# Altium project US29080671(A).PrjPCB (part 4 of 10)

## Sheet POWER_B2.SchDoc
size A4
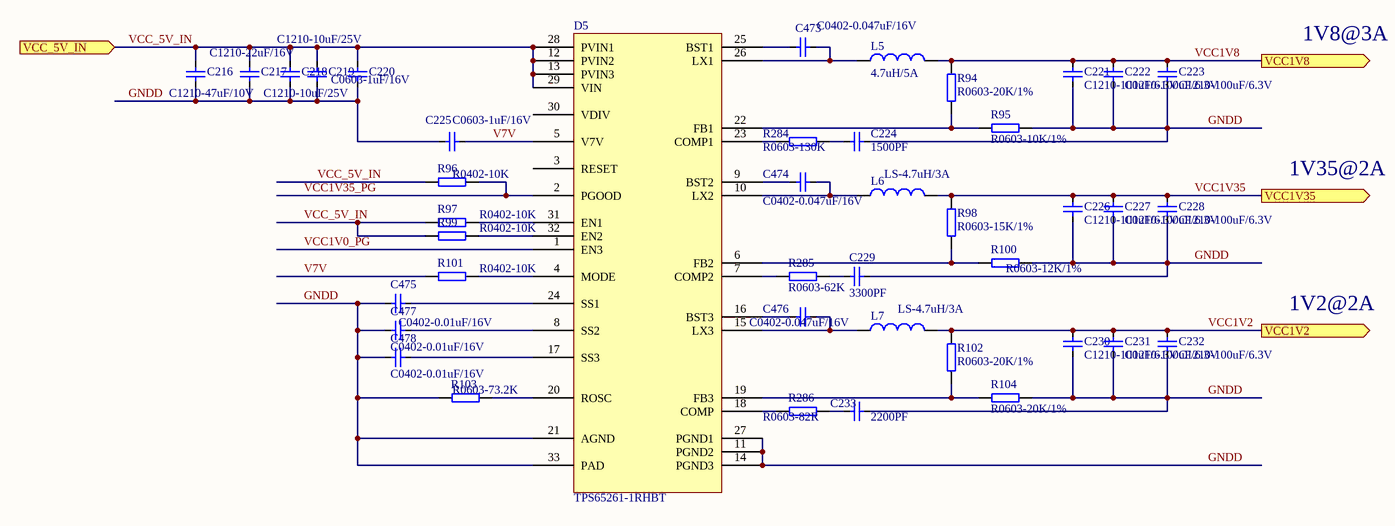
[diagram p19: POWER_B2.SchDoc]

### Parts
C216  C1210-47uF/10V  [C1210]
C217  C1210-22uF/16V  [C1210]
C218  C1210-10uF/25V  [C1210]
C219  C1210-10uF/25V  [C1210]
C220  C0603-1uF/16V  [C0603]
C221  C1210-100uF/6.3V  [C1210]
C222  C1210-100uF/6.3V  [C1210]
C223  C1210-100uF/6.3V  [C1210]
C224  1500PF  [C0603]
C225  C0603-1uF/16V  [C0603]
C226  C1210-100uF/6.3V  [C1210]
C227  C1210-100uF/6.3V  [C1210]
C228  C1210-100uF/6.3V  [C1210]
C229  3300PF  [C0603]
C230  C1210-100uF/6.3V  [C1210]
C231  C1210-100uF/6.3V  [C1210]
C232  C1210-100uF/6.3V  [C1210]
C233  2200PF  [C0603]
C473  C0402-0.047uF/16V  [C0402]
C474  C0402-0.047uF/16V  [C0402]
C475  C0402-0.01uF/16V  [C0402]
C476  C0402-0.047uF/16V  [C0402]
C477  C0402-0.01uF/16V  [C0402]
C478  C0402-0.01uF/16V  [C0402]
D5  TPS65261-1RHBT  [QFN-32N]
L5  4.7uH/5A  [LSMD12-13X13]
L6  LS-4.7uH/3A  [FMJ-0630T]
L7  LS-4.7uH/3A  [FMJ-0630T]
R94  R0603-20K/1%  [R0603]
R95  R0603-10K/1%  [R0603]
R96  R0402-10K  [R0402]
R97  R0402-10K  [R0402]
R98  R0603-15K/1%  [R0603]
R99  R0402-10K  [R0402]
R100  R0603-12K/1%  [R0603]
R101  R0402-10K  [R0402]
R102  R0603-20K/1%  [R0603]
R103  R0603-73.2K  [R0603]
R104  R0603-20K/1%  [R0603]
R284  R0603-130K  [R0603]
R285  R0603-62K  [R0603]
R286  R0603-82R  [R0603]

### Ports
VCC1V2 (out), VCC1V8 (out), VCC1V35 (out), VCC_5V_IN (in)

### Nets
GNDD: C216.2 C217.2 C218.2 C219.2 C220.2 C221.2 C222.2 C223.2 C224.2 C225.1 C226.2 C227.2 C228.2 C229.2 C230.2 C231.2 C232.2 C233.2 C475.1 C477.1 C478.1 D5.11(PGND2) D5.14(PGND3) D5.21(AGND) D5.27(PGND1) D5.33(PAD) R95.2 R100.2 R103.1 R104.2
VCC1V2: C230.1 C231.1 C232.1 L7.2 R102.2 ; port VCC1V2
VCC1V8: C221.1 C222.1 C223.1 L5.2 R94.2 ; port VCC1V8
VCC1V35: C226.1 C227.1 C228.1 L6.2 R98.2 ; port VCC1V35
V7V: C225.2 D5.5(V7V) R101.1
VCC1V0_PG: D5.1(EN3)
VCC1V35_PG: D5.2(PGOOD) R96.2
VCC_5V_IN: C216.1 C217.1 C218.1 C219.1 C220.1 D5.12(PVIN2) D5.13(PVIN3) D5.28(PVIN1) D5.29(VIN) R96.1 R97.1 R99.1 ; port VCC_5V_IN
NetC224_1: C224.1 R284.2
NetC229_1: C229.1 R285.2
NetC233_1: C233.1 R286.2
NetC473_1: C473.1 D5.25(BST1)
NetC473_2: C473.2 D5.26(LX1) L5.1
NetC474_1: C474.1 D5.9(BST2)
NetC474_2: C474.2 D5.10(LX2) L6.1
NetC475_2: C475.2 D5.24(SS1)
NetC476_1: C476.1 D5.16(BST3)
NetC476_2: C476.2 D5.15(LX3) L7.1
NetC477_2: C477.2 D5.8(SS2)
NetC478_2: C478.2 D5.17(SS3)
NetD5_4: D5.4(MODE) R101.2
NetD5_6: D5.6(FB2) R98.1 R100.1
NetD5_7: D5.7(COMP2) R285.1
NetD5_18: D5.18(COMP) R286.1
NetD5_19: D5.19(FB3) R102.1 R104.1
NetD5_20: D5.20(ROSC) R103.2
NetD5_22: D5.22(FB1) R94.1 R95.1
NetD5_23: D5.23(COMP1) R284.1
NetD5_31: D5.31(EN1) R97.2
NetD5_32: D5.32(EN2) R99.2

Not connected (* = marked no-connect by the designer): D5 3(RESET) 30(VDIV)

### Notes on the sheet
- 1V8@3A
- 1V35@2A
- 1V2@2A

### Library data of the parts
C216 C218 C219 C221-C223 C226-C228 C230-C232 = C1210-22uF/16V: Part_type: CAP; Schematic_Part: CAP; PCB_Footprint: C1210
  C216: Part_number: C1210-47uF/10V; Value: C1210-47uF/10V
  C218 C219: Part_number: C1210-10uF/25V; Value: C1210-10uF/25V
  C221-C223 C226-C228 C230-C232: Part_number: C1210-100uF/6.3V; Value: C1210-100uF/6.3V
C220 C225 = C0603-100nF/16V: X7R; Part_number: C0603-1uF/16V; Part_type: CAP; Value: C0603-1uF/16V; temperature: -55℃\+125℃; Schematic_Part: CAP; PCB_Footprint: C0603
C224 C229 C233 = C1210-22uF/16V: PCB_Footprint: C1210; Part_type: CAP; Schematic_Part: CAP
  C224: Part_number: 1500PF; Value: 1500PF
  C229: Part_number: 3300PF; Value: 3300PF
  C233: Part_number: 2200PF; Value: 2200PF
C473-C478 = C0402-0.1uF/16V: as C3 on sheet A7_JTAG&CONFIG - Ⅱ; Part_type: CAP; temperature: -55℃\+125℃; Schematic_Part: CAP; PCB_Footprint: C0402; datasheet: #DataSheet\C_Samsung_General Capacitors.pdf#
  C473 C474 C476: Part_number: C0402-0.047uF/16V; Value: C0402-0.047uF/16V
  C475 C477 C478: Part_number: C0402-0.01uF/16V; Value: C0402-0.01uF/16V
D5 = TPS65261RHBT: Part_number: TPS65261-1RHBT
L5 = LS-6.8uH/5A: Part_number: 4.7uH/5A; Part_type: INDUCTOR; Value1: 6.8uH/5A; Schematic_Part: INDUCTOR; PCB_Footprint: LSMD12-13X13
L6 L7 = LS-4.7uH/5.5A: 7.3*6.6*3mm,4.7uH/5.5A,40mR,20%,TMP; Manufacturer_p/n: FMJ-0630T-4R7 HF; Part_number: LS-4.7uH/3A; Part_type: INDUCTOR; temperature: -55℃\+125℃; Value1: 4.7uH/3A; Schematic_Part: INDUCTOR; PCB_Footprint: FMJ-0630T; Manufacturer: TMP; datasheet: #DataSheet\IND_TMP_FMJ-0630T.pdf#
R94 R95 R98 R100 R103 R284-R286 = R0603-0R: as R2 on sheet POWER_B1; Part_type: RES; Schematic_Part: RES; PCB_Footprint: R0603; Manufacturer_p/n2: SAMSUNG
  R94: Part_number: R0603-20K/1%; Value: R0603-20K/1%
  R95: Part_number: R0603-10K/1%; Value: R0603-10K/1%
  R98: Part_number: R0603-15K/1%; Value: R0603-15K/1%
  R100: Part_number: R0603-12K/1%; Value: R0603-12K/1%
  R103: Part_number: R0603-73.2K; Value: R0603-73.2K
  R284: Part_number: R0603-130K; Value: R0603-130K
  R285: Part_number: R0603-62K; Value: R0603-62K
  R286: Part_number: R0603-82R; Value: R0603-82R
R96 R97 R99 R101 = R0402-10K: Manufacturer: SAMSUNG; Part_number: R0402-10K; Part_type: RES; Value: R0402-10K; Schematic_Part: RES; PCB_Footprint: R0402
R102 = R0603-0R: Manufacturer: HKT; Manufacturer_p/n: RI0603L000JT; Value: R0603-10K/1%; Part_number: R0603-20K/1%; Part_type: RES; Schematic_Part: RES; PCB_Footprint: R0603; Manufacturer_p/n2: SAMSUNG
R104 = R0603-0R: Manufacturer: HKT; Manufacturer_p/n: RI0603L000JT; Value: R0603-12K/1%; Part_number: R0603-20K/1%; Part_type: RES; Schematic_Part: RES; PCB_Footprint: R0603; Manufacturer_p/n2: SAMSUNG
C217 = C1210-22uF/16V: Part_number: C1210-22uF/16V; Part_type: CAP; Value: C1210-22uF/16V; Schematic_Part: CAP; PCB_Footprint: C1210

## Sheet POWER_B3.SchDoc
size A4
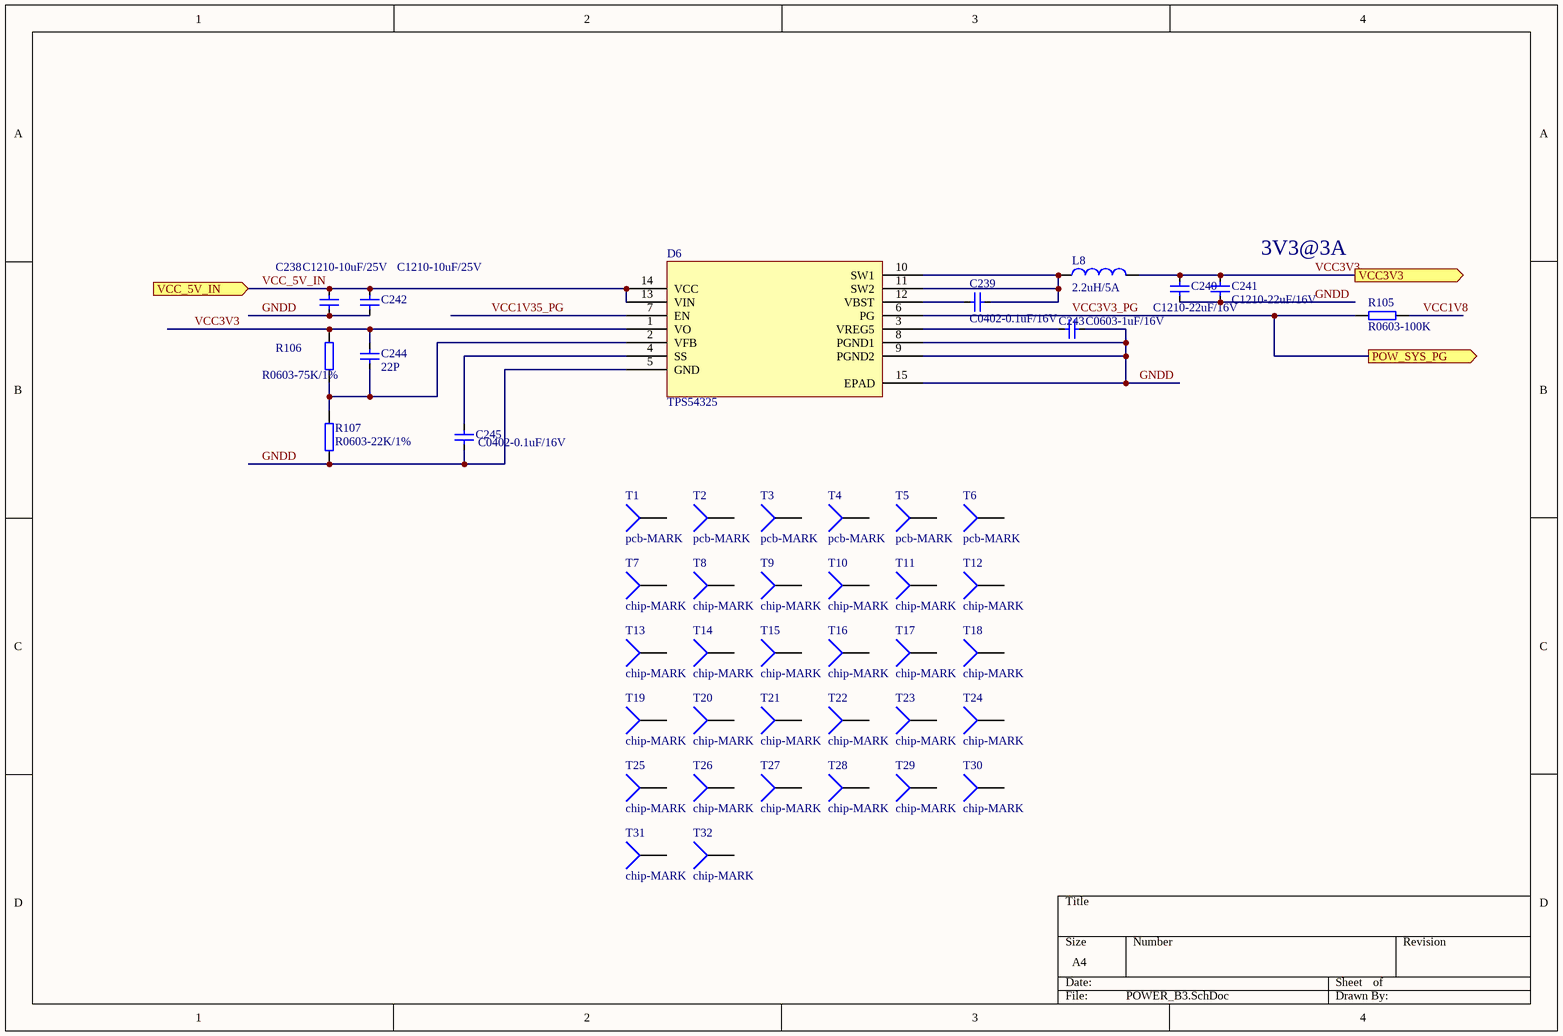
[diagram p20: POWER_B3.SchDoc]

### Parts
C238  C1210-10uF/25V  [C1210]
C239  C0402-0.1uF/16V  [C0402]
C240  C1210-22uF/16V  [C1210]
C241  C1210-22uF/16V  [C1210]
C242  C1210-10uF/25V  [C1210]
C243  C0603-1uF/16V  [C0603]
C244  22P  [C0603]
C245  C0402-0.1uF/16V  [C0402]
D6  TPS54325  [HTSSOP-14]
L8  2.2uH/5A  [LSMD12-13X13]
R105  R0603-100K  [R0603]
R106  R0603-75K/1%  [R0603]
R107  R0603-22K/1%  [R0603]
T1  pcb-MARK  [pcb-MARK]
T2  pcb-MARK  [pcb-MARK]
T3  pcb-MARK  [pcb-MARK]
T4  pcb-MARK  [pcb-MARK]
T5  pcb-MARK  [pcb-MARK]
T6  pcb-MARK  [pcb-MARK]
T7  chip-MARK  [chip-MARK]
T8  chip-MARK  [chip-MARK]
T9  chip-MARK  [chip-MARK]
T10  chip-MARK  [chip-MARK]
T11  chip-MARK  [chip-MARK]
T12  chip-MARK  [chip-MARK]
T13  chip-MARK  [chip-MARK]
T14  chip-MARK  [chip-MARK]
T15  chip-MARK  [chip-MARK]
T16  chip-MARK  [chip-MARK]
T17  chip-MARK  [chip-MARK]
T18  chip-MARK  [chip-MARK]
T19  chip-MARK  [chip-MARK]
T20  chip-MARK  [chip-MARK]
T21  chip-MARK  [chip-MARK]
T22  chip-MARK  [chip-MARK]
T23  chip-MARK  [chip-MARK]
T24  chip-MARK  [chip-MARK]
T25  chip-MARK  [chip-MARK]
T26  chip-MARK  [chip-MARK]
T27  chip-MARK  [chip-MARK]
T28  chip-MARK  [chip-MARK]
T29  chip-MARK  [chip-MARK]
T30  chip-MARK  [chip-MARK]
T31  chip-MARK  [chip-MARK]
T32  chip-MARK  [chip-MARK]

### Ports
POW_SYS_PG (out), VCC3V3 (out), VCC_5V_IN (in)

### Nets
GNDD: C238.2 C240.2 C241.2 C242.2 C243.2 C245.2 D6.5(GND) D6.8(PGND1) D6.9(PGND2) D6.15(EPAD) R107.1
VCC1V8: R105.2
VCC3V3: C240.1 C241.1 C244.1 D6.1(VO) L8.2 R106.2 ; port VCC3V3
VCC1V35_PG: D6.7(EN)
VCC3V3_PG: D6.6(PG) R105.1 ; port POW_SYS_PG  [project net POW_SYS_PG]
VCC_5V_IN: C238.1 C242.1 D6.13(VIN) D6.14(VCC) ; port VCC_5V_IN
NetC239_1: C239.1 D6.12(VBST)
NetC239_2: C239.2 D6.10(SW1) D6.11(SW2) L8.1
NetC243_1: C243.1 D6.3(VREG5)
NetC244_2: C244.2 D6.2(VFB) R106.1 R107.2
NetC245_1: C245.1 D6.4(SS)

Not connected (* = marked no-connect by the designer): T1 1; T2 1; T3 1; T4 1; T5 1; T6 1; T7 1; T8 1; T9 1; T10 1; T11 1; T12 1; T13 1; T14 1; T15 1; T16 1; T17 1; T18 1; T19 1; T20 1; T21 1; T22 1; T23 1; T24 1; T25 1; T26 1; T27 1; T28 1; T29 1; T30 1; T31 1; T32 1

### Notes on the sheet
- 3V3@3A

### Library data of the parts
C238 C242 = C1210-22uF/16V: Part_number: C1210-10uF/25V; Part_type: CAP; Value: C1210-10uF/25V; Schematic_Part: CAP; PCB_Footprint: C1210
C239 C245 = C0402-0.1uF/16V: as C3 on sheet A7_JTAG&CONFIG - Ⅱ; Part_number: C0402-0.1uF/16V; Part_type: CAP; Value: C0402-0.1uF/16V; temperature: -55℃\+125℃; Schematic_Part: CAP; PCB_Footprint: C0402; datasheet: #DataSheet\C_Samsung_General Capacitors.pdf#
C243 C244 = C0603-100nF/16V: X7R; Part_type: CAP; temperature: -55℃\+125℃; Schematic_Part: CAP; PCB_Footprint: C0603
  C243: Part_number: C0603-1uF/16V; Value: C0603-1uF/16V
  C244: Part_number: 22P; Value: 22P
L8 = LS-6.8uH/5A: Part_number: 2.2uH/5A; Part_type: INDUCTOR; Value1: 6.8uH/5A; Schematic_Part: INDUCTOR; PCB_Footprint: LSMD12-13X13
R105-R107 = R0603-0R: as R2 on sheet POWER_B1; Part_type: RES; Schematic_Part: RES; PCB_Footprint: R0603; Manufacturer_p/n2: SAMSUNG
  R105: Part_number: R0603-100K; Value: R0603-100K
  R106: Part_number: R0603-75K/1%; Value: R0603-75K/1%
  R107: Part_number: R0603-22K/1%; Value: R0603-22K/1%
T1-T6 = pcb-MARK: PCB标示 MARK点; Part_type: Miscellaneous; Part_number: pcb-MARK; Value: pcb-MARK; Schematic_Part: pcb-MARK; PCB_Footprint: pcb-MARK
T7-T32 = chip-MARK: 芯片标示 MARK点; Part_type: Miscellaneous; Part_number: chip-MARK; Value: chip-MARK; Schematic_Part: chip-MARK; PCB_Footprint: chip-MARK
C240 C241 = C1210-22uF/16V: Part_number: C1210-22uF/16V; Part_type: CAP; Value: C1210-22uF/16V; Schematic_Part: CAP; PCB_Footprint: C1210
D6 = TPS54325: Part_number: TPS54325

## Sheet MY_beamControl_R_组件电源分配.SchDoc
size A3
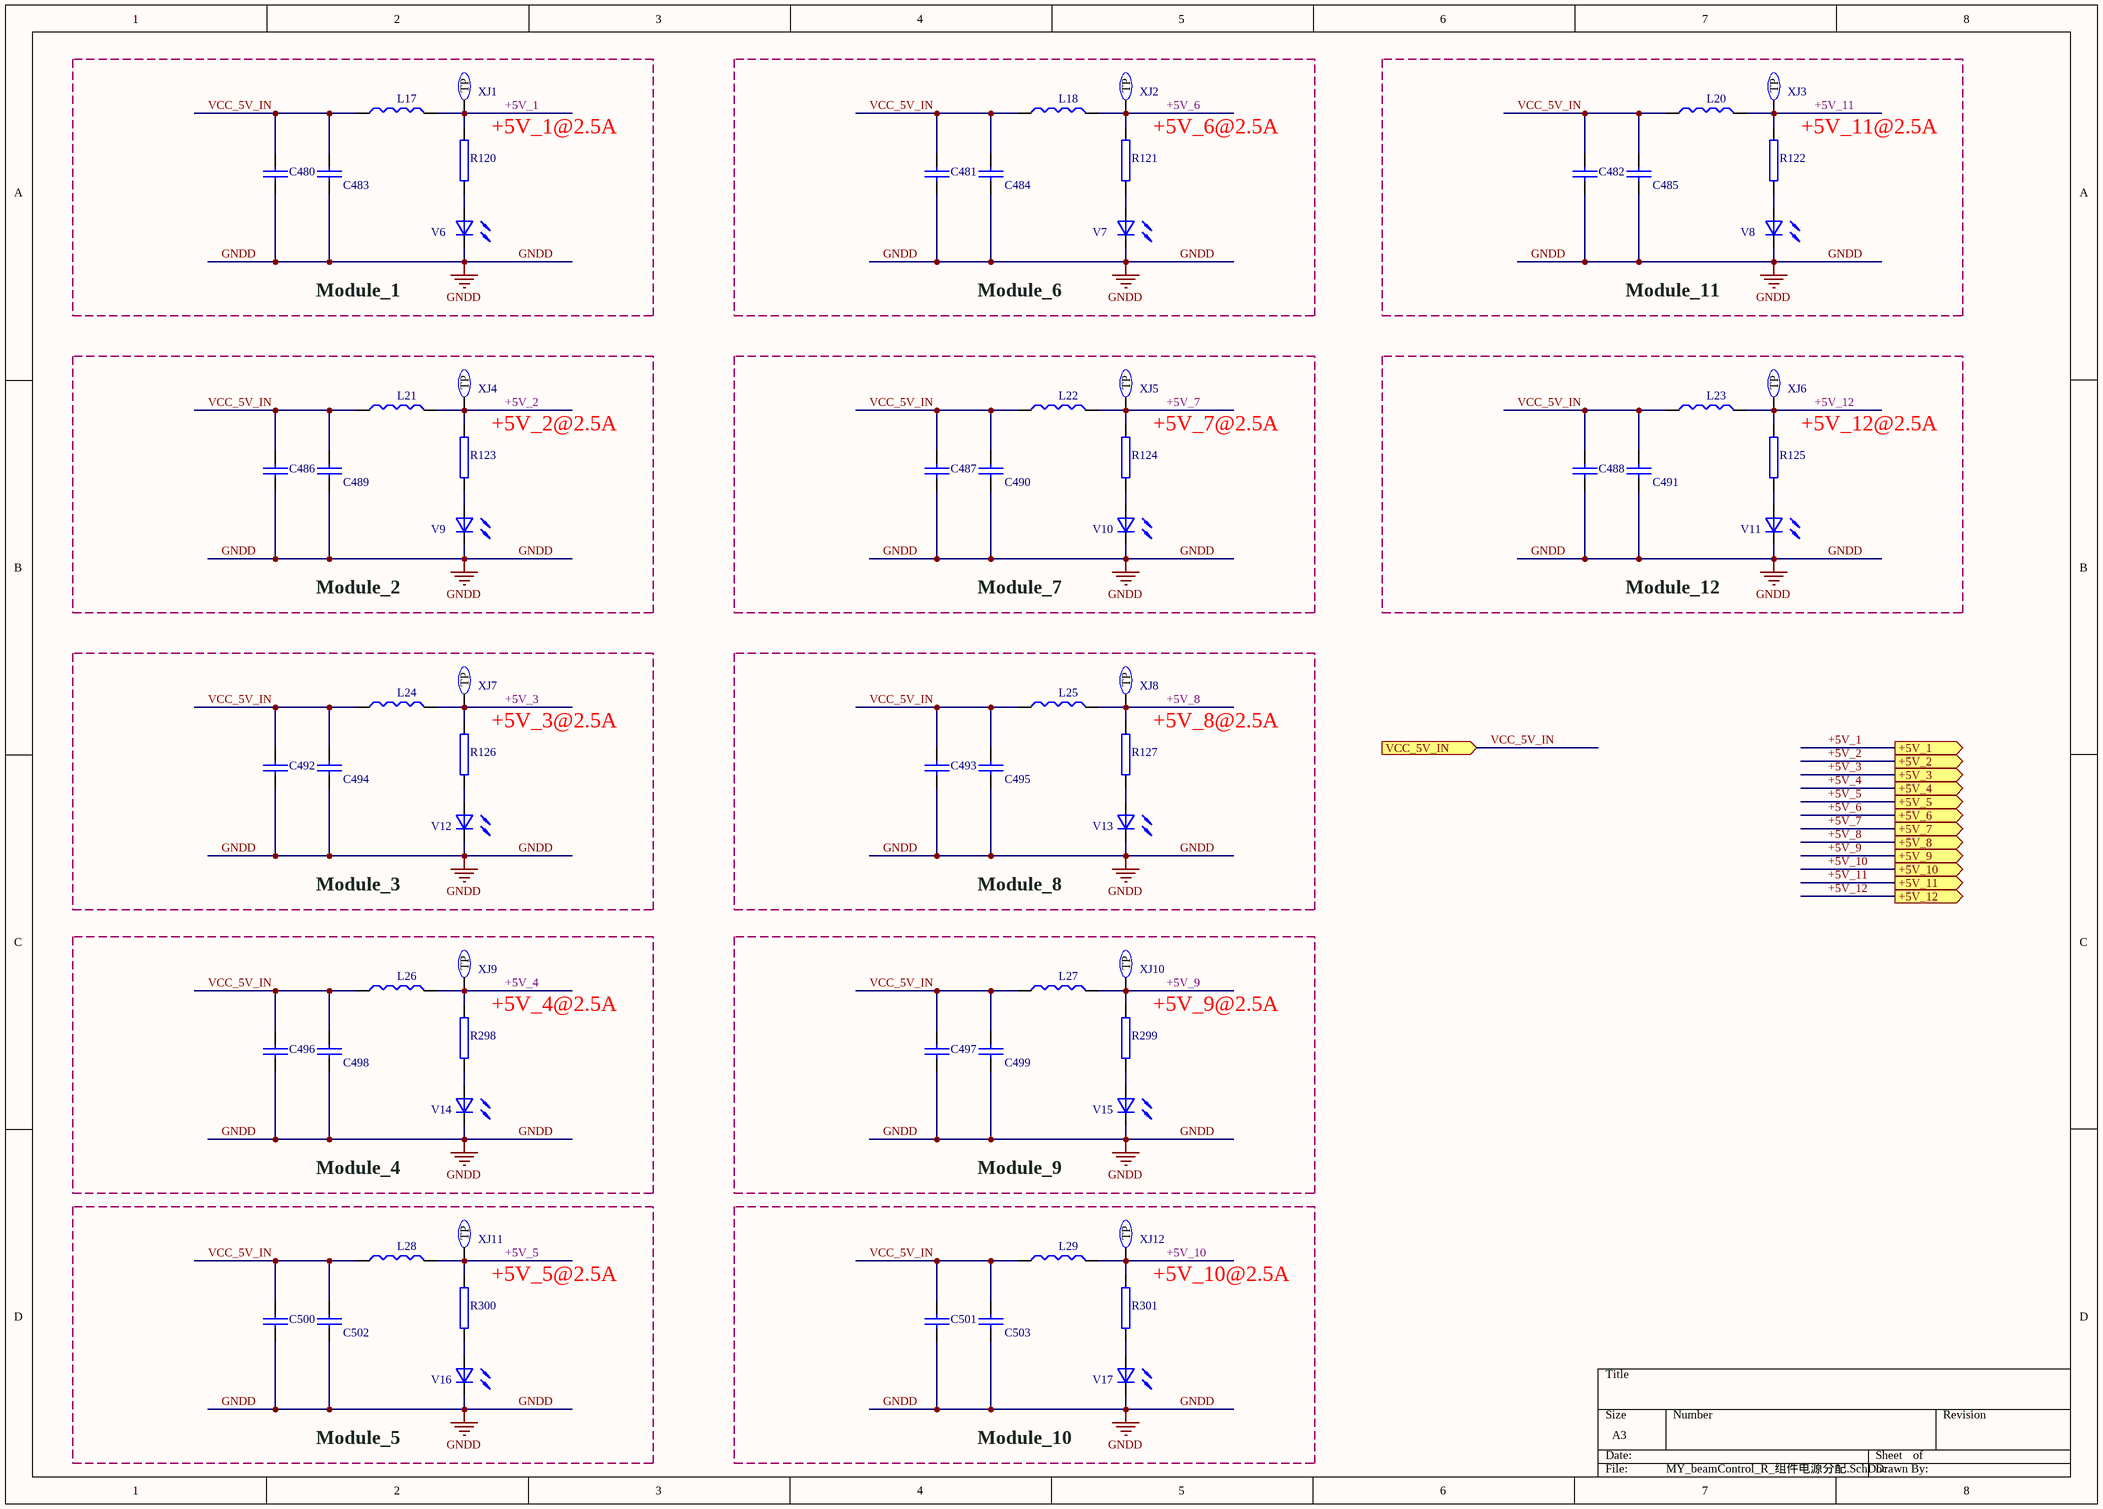
[diagram p21: MY_beamControl_R_组件电源分配.SchDoc]

### Parts
C480  C0805-4.7uF/16V  [0805]  (value not drawn)
C481  C0805-4.7uF/16V  [0805]  (value not drawn)
C482  C0805-4.7uF/16V  [0805]  (value not drawn)
C483  CT41-0402-2X1-16V-104(0.1μF)  [c0402]  (value not drawn)
C484  CT41-0402-2X1-16V-104(0.1μF)  [c0402]  (value not drawn)
C485  CT41-0402-2X1-16V-104(0.1μF)  [c0402]  (value not drawn)
C486  C0805-4.7uF/16V  [0805]  (value not drawn)
C487  C0805-4.7uF/16V  [0805]  (value not drawn)
C488  C0805-4.7uF/16V  [C0805]  (value not drawn)
C489  CT41-0402-2X1-16V-104(0.1μF)  [c0402]  (value not drawn)
C490  CT41-0402-2X1-16V-104(0.1μF)  [c0402]  (value not drawn)
C491  CT41-0402-2X1-16V-104(0.1μF)  [c0402]  (value not drawn)
C492  C0805-4.7uF/16V  [0805]  (value not drawn)
C493  C0805-4.7uF/16V  [0805]  (value not drawn)
C494  CT41-0402-2X1-16V-104(0.1μF)  [c0402]  (value not drawn)
C495  CT41-0402-2X1-16V-104(0.1μF)  [c0402]  (value not drawn)
C496  C0805-4.7uF/16V  [0805]  (value not drawn)
C497  C0805-4.7uF/16V  [0805]  (value not drawn)
C498  CT41-0402-2X1-16V-104(0.1μF)  [c0402]  (value not drawn)
C499  CT41-0402-2X1-16V-104(0.1μF)  [c0402]  (value not drawn)
C500  C0805-4.7uF/16V  [0805]  (value not drawn)
C501  C0805-4.7uF/16V  [0805]  (value not drawn)
C502  CT41-0402-2X1-16V-104(0.1μF)  [c0402]  (value not drawn)
C503  CT41-0402-2X1-16V-104(0.1μF)  [c0402]  (value not drawn)
L17  MPZ2012S101A  [R0805]  (value not drawn)
L18  MPZ2012S101A  [R0805]  (value not drawn)
L20  MPZ2012S101A  [R0805]  (value not drawn)
L21  MPZ2012S101A  [R0805]  (value not drawn)
L22  MPZ2012S101A  [R0805]  (value not drawn)
L23  MPZ2012S101A  [R0805]  (value not drawn)
L24  MPZ2012S101A  [R0805]  (value not drawn)
L25  MPZ2012S101A  [R0805]  (value not drawn)
L26  MPZ2012S101A  [R0805]  (value not drawn)
L27  MPZ2012S101A  [R0805]  (value not drawn)
L28  MPZ2012S101A  [R0805]  (value not drawn)
L29  MPZ2012S101A  [R0805]  (value not drawn)
R120  0805-512(5.1K)  [0805]  (value not drawn)
R121  0805-512(5.1K)  [0805]  (value not drawn)
R122  0805-512(5.1K)  [0805]  (value not drawn)
R123  0805-512(5.1K)  [0805]  (value not drawn)
R124  0805-512(5.1K)  [0805]  (value not drawn)
R125  0805-512(5.1K)  [0805]  (value not drawn)
R126  0805-512(5.1K)  [0805]  (value not drawn)
R127  0805-512(5.1K)  [0805]  (value not drawn)
R298  0805-512(5.1K)  [0805]  (value not drawn)
R299  0805-512(5.1K)  [0805]  (value not drawn)
R300  0805-512(5.1K)  [0805]  (value not drawn)
R301  0805-512(5.1K)  [0805]  (value not drawn)
V6  LED0603-GREEN  [LED-R0603]  (value not drawn)
V7  LED0603-GREEN  [LED-R0603]  (value not drawn)
V8  LED0603-GREEN  [LED-R0603]  (value not drawn)
V9  LED0603-GREEN  [LED-R0603]  (value not drawn)
V10  LED0603-GREEN  [LED-R0603]  (value not drawn)
V11  LED0603-GREEN  [LED-R0603]  (value not drawn)
V12  LED0603-GREEN  [LED-R0603]  (value not drawn)
V13  LED0603-GREEN  [LED-R0603]  (value not drawn)
V14  LED0603-GREEN  [LED-R0603]  (value not drawn)
V15  LED0603-GREEN  [LED-R0603]  (value not drawn)
V16  LED0603-GREEN  [LED-R0603]  (value not drawn)
V17  LED0603-GREEN  [LED-R0603]  (value not drawn)
XJ1  Test Point  [TP3]  (value not drawn)
XJ2  Test Point  [TP3]  (value not drawn)
XJ3  Test Point  [TP3]  (value not drawn)
XJ4  Test Point  [TP3]  (value not drawn)
XJ5  Test Point  [TP3]  (value not drawn)
XJ6  Test Point  [TP3]  (value not drawn)
XJ7  Test Point  [TP3]  (value not drawn)
XJ8  Test Point  [TP3]  (value not drawn)
XJ9  Test Point  [TP3]  (value not drawn)
XJ10  Test Point  [TP3]  (value not drawn)
XJ11  Test Point  [TP3]  (value not drawn)
XJ12  Test Point  [TP3]  (value not drawn)

### Blocks framed on the sheet
+5V_1@2.5A: C480 C483 L17 R120 V6 XJ1
+5V_6@2.5A: C481 C484 L18 R121 V7 XJ2
+5V_11@2.5A: C482 C485 L20 R122 V8 XJ3
+5V_2@2.5A: C486 C489 L21 R123 V9 XJ4
+5V_7@2.5A: C487 C490 L22 R124 V10 XJ5
+5V_12@2.5A: C488 C491 L23 R125 V11 XJ6
+5V_3@2.5A: C492 C494 L24 R126 V12 XJ7
+5V_8@2.5A: C493 C495 L25 R127 V13 XJ8
+5V_4@2.5A: C496 C498 L26 R298 V14 XJ9
+5V_9@2.5A: C497 C499 L27 R299 V15 XJ10
+5V_5@2.5A: C500 C502 L28 R300 V16 XJ11
+5V_10@2.5A: C501 C503 L29 R301 V17 XJ12

### Ports
+5V_1 (out), +5V_2 (out), +5V_3 (out), +5V_4 (out), +5V_5 (out), +5V_6 (out), +5V_7 (out), +5V_8 (out), +5V_9 (out), +5V_10 (out), +5V_11 (out), +5V_12 (out), VCC_5V_IN (in)

### Nets
GNDD: C480.1 C481.1 C482.1 C483.2 C484.2 C485.2 C486.1 C487.1 C488.1 C489.2 C490.2 C491.2 C492.1 C493.1 C494.2 C495.2 C496.1 C497.1 C498.2 C499.2 C500.1 C501.1 C502.2 C503.2 V6.2(K) V7.2(K) V8.2(K) V9.2(K) V10.2(K) V11.2(K) V12.2(K) V13.2(K) V14.2(K) V15.2(K) V16.2(K) V17.2(K)
+5V_1: L17.2 R120.2 XJ1.1(TP) ; port +5V_1
+5V_2: L21.2 R123.2 XJ4.1(TP) ; port +5V_2
+5V_3: L24.2 R126.2 XJ7.1(TP) ; port +5V_3
+5V_4: L26.2 R298.2 XJ9.1(TP) ; port +5V_4
+5V_5: L28.2 R300.2 XJ11.1(TP) ; port +5V_5
+5V_6: L18.2 R121.2 XJ2.1(TP) ; port +5V_6
+5V_7: L22.2 R124.2 XJ5.1(TP) ; port +5V_7
+5V_8: L25.2 R127.2 XJ8.1(TP) ; port +5V_8
+5V_9: L27.2 R299.2 XJ10.1(TP) ; port +5V_9
+5V_10: L29.2 R301.2 XJ12.1(TP) ; port +5V_10
+5V_11: L20.2 R122.2 XJ3.1(TP) ; port +5V_11
+5V_12: L23.2 R125.2 XJ6.1(TP) ; port +5V_12
VCC_5V_IN: C480.2 C481.2 C482.2 C483.1 C484.1 C485.1 C486.2 C487.2 C488.2 C489.1 C490.1 C491.1 C492.2 C493.2 C494.1 C495.1 C496.2 C497.2 C498.1 C499.1 C500.2 C501.2 C502.1 C503.1 L17.1 L18.1 L20.1 L21.1 L22.1 L23.1 L24.1 L25.1 L26.1 L27.1 L28.1 L29.1 ; port VCC_5V_IN
NetR120_1: R120.1 V6.1(A)
NetR121_1: R121.1 V7.1(A)
NetR122_1: R122.1 V8.1(A)
NetR123_1: R123.1 V9.1(A)
NetR124_1: R124.1 V10.1(A)
NetR125_1: R125.1 V11.1(A)
NetR126_1: R126.1 V12.1(A)
NetR127_1: R127.1 V13.1(A)
NetR298_1: R298.1 V14.1(A)
NetR299_1: R299.1 V15.1(A)
NetR300_1: R300.1 V16.1(A)
NetR301_1: R301.1 V17.1(A)

### Notes on the sheet
- Module_1
- Module_6
- Module_11
- Module_2
- Module_7
- Module_12
- Module_3
- Module_8
- Module_4
- Module_9
- Module_5
- Module_10

### Library data of the parts
C480-C482 C486-C488 C492 C493 C496 C497 C500 C501 = C
C483-C485 C489-C491 C494 C495 C498 C499 C502 C503 = C_2
L17 L18 L20-L29 = ProE2A0.TMP_UnNamed_1
R120-R127 R298-R301 = RES2
V6-V17 = LED: Part Field 1: 3
XJ1-XJ12 = TP: 测试点